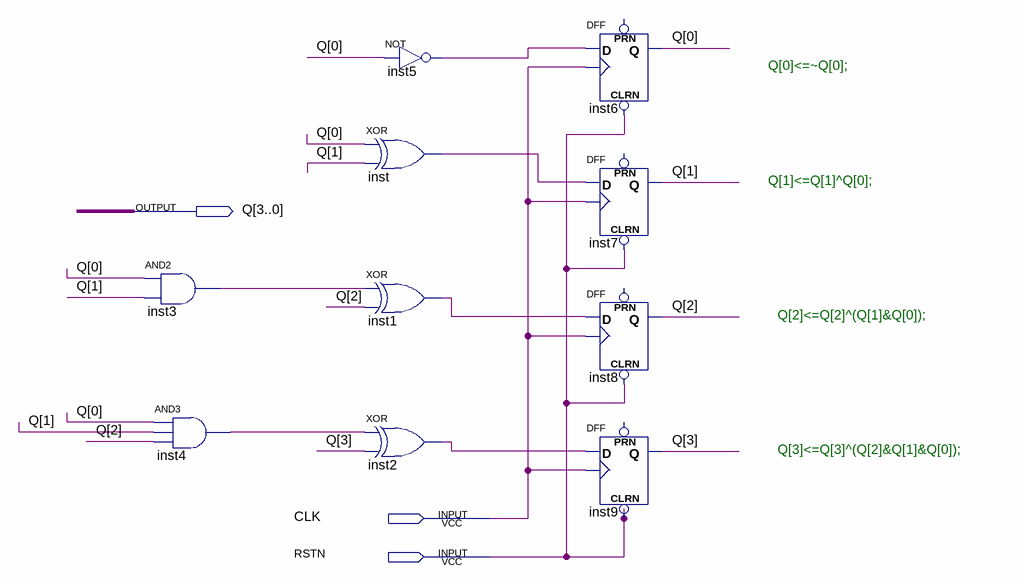
[diagram p0: schematic sheet]
// Quartus schematic lab401Counter4.bdf as structural Verilog: 10 symbols, 3 pins
module lab401Counter4 (
  input  CLK,
  input  RSTN,
  output [3:0] Q
);

  wire inst1_out, inst2_out, inst3_out, inst4_out, inst5_out, inst_out;

  and inst3 (inst3_out, Q[0], Q[1]);
  and inst4 (inst4_out, Q[0], Q[1], Q[2]);
  not inst5 (inst5_out, Q[0]);
  xor inst (inst_out, Q[0], Q[1]);
  xor inst1 (inst1_out, inst3_out, Q[2]);
  xor inst2 (inst2_out, inst4_out, Q[3]);
  DFF inst6 (.CLRN(RSTN), .CLK(CLK), .D(inst5_out), .Q(Q[0]));  // open: PRN
  DFF inst7 (.CLRN(RSTN), .CLK(CLK), .D(inst_out), .Q(Q[1]));  // open: PRN
  DFF inst8 (.CLRN(RSTN), .CLK(CLK), .D(inst1_out), .Q(Q[2]));  // open: PRN
  DFF inst9 (.CLRN(RSTN), .CLK(CLK), .D(inst2_out), .Q(Q[3]));  // open: PRN

  // Notes on the sheet:
  //   Q[0]<=~Q[0];
  //   Q[1]<=Q[1]^Q[0];
  //   Q[2]<=Q[2]^(Q[1]&Q[0]);
  //   Q[3]<=Q[3]^(Q[2]&Q[1]&Q[0]);
endmodule
